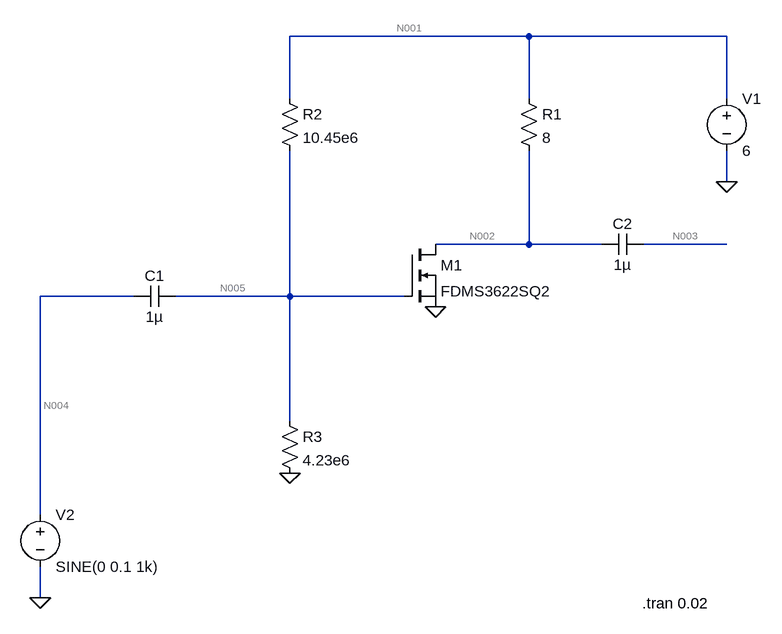
[diagram p0: schematic Draft3.asc]
Draft3.asc, the LTspice schematic file:
Version 4
SHEET 1 880 824
WIRE 192 -80 -176 -80
WIRE 496 -80 192 -80
WIRE -176 16 -176 -80
WIRE 192 16 192 -80
WIRE 496 16 496 -80
WIRE 496 144 496 96
WIRE 192 240 192 96
WIRE 192 240 48 240
WIRE 304 240 192 240
WIRE 496 240 368 240
WIRE -416 320 -560 320
WIRE -176 320 -176 96
WIRE -176 320 -352 320
WIRE 0 320 -176 320
WIRE -176 512 -176 320
WIRE -560 656 -560 320
WIRE -560 784 -560 736
FLAG -176 592 0
FLAG 48 336 0
FLAG 496 144 0
FLAG -560 784 0
SYMBOL voltage 496 0 R0
SYMATTR InstName V1
SYMATTR Value 6
SYMBOL voltage -560 640 R0
WINDOW 123 0 0 Left 0
WINDOW 39 0 0 Left 0
SYMATTR InstName V2
SYMATTR Value SINE(0 0.1 1k)
SYMBOL nmos 0 240 R0
SYMATTR InstName M1
SYMATTR Value FDMS3622SQ2
SYMBOL res 176 0 R0
SYMATTR InstName R1
SYMATTR Value 8
SYMBOL res -192 0 R0
SYMATTR InstName R2
SYMATTR Value 10.45e6
SYMBOL res -192 496 R0
SYMATTR InstName R3
SYMATTR Value 4.23e6
SYMBOL cap -352 304 R90
WINDOW 0 0 32 VBottom 2
WINDOW 3 32 32 VTop 2
SYMATTR InstName C1
SYMATTR Value 1µ
SYMBOL cap 368 224 R90
WINDOW 0 0 32 VBottom 2
WINDOW 3 32 32 VTop 2
SYMATTR InstName C2
SYMATTR Value 1µ
TEXT 366 792 Left 2 !.tran 0.02

The netlist it stands for:
* Draft3.asc
V1 N001 0 6
V2 N004 0 SINE(0 0.1 1k)
M1 N002 N005 0 0 FDMS3622SQ2
R1 N001 N002 8
R2 N001 N005 10.45e6
R3 N005 0 4.23e6
C1 N005 N004 1µ
C2 N003 N002 1µ
.model NMOS NMOS
.model PMOS PMOS
.lib standard.mos
.tran 0.02
.backanno
.end

* Results of the author's LTspice run, read from the files saved beside the schematic
* Operating Point, zero values left out:
*   V(n001) = 6 V
*   V(n002) = 4.316 V
*   V(n005) = 1.729 V
*   V(n003) = 4.316 µV
*   Id(M1) = 210.5 mA
*   Is(M1) = -210.5 mA
*   I(R3) = 408.7 nA
*   I(R2) = 408.7 nA
*   I(R1) = 210.5 mA
*   I(V1) = -210.5 mA
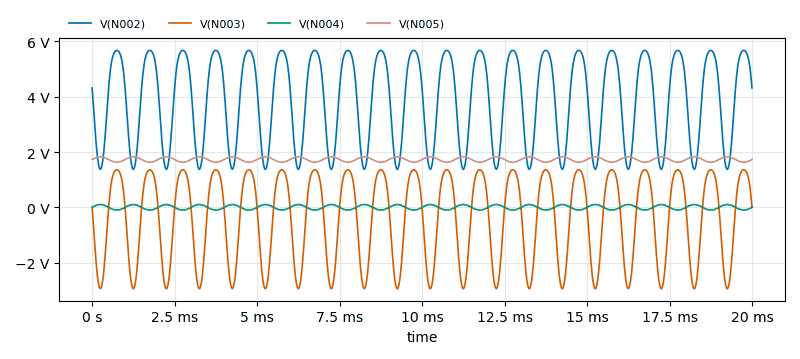
[diagram p1: Transient Analysis of Draft3.asc, plotted from the saved traces]
* Transient Analysis, 1 run:
*   V(N002): min 1.371 V, max 5.674 V, average 3.887 V, rms 4.196 V, last 4.316 V
*   V(N003): min -2.945 V, max 1.358 V, average -429 mV, rms 1.637 V, last 319.5 µV
*   V(N004): min -100 mV, max 100 mV, average 30.76 nV, rms 70.71 mV, last 0 V
*   V(N005): min 1.63 V, max 1.826 V, average 1.728 V, rms 1.73 V, last 1.729 V